# Altium schematic sheet HVSchematic.SchDoc
size A
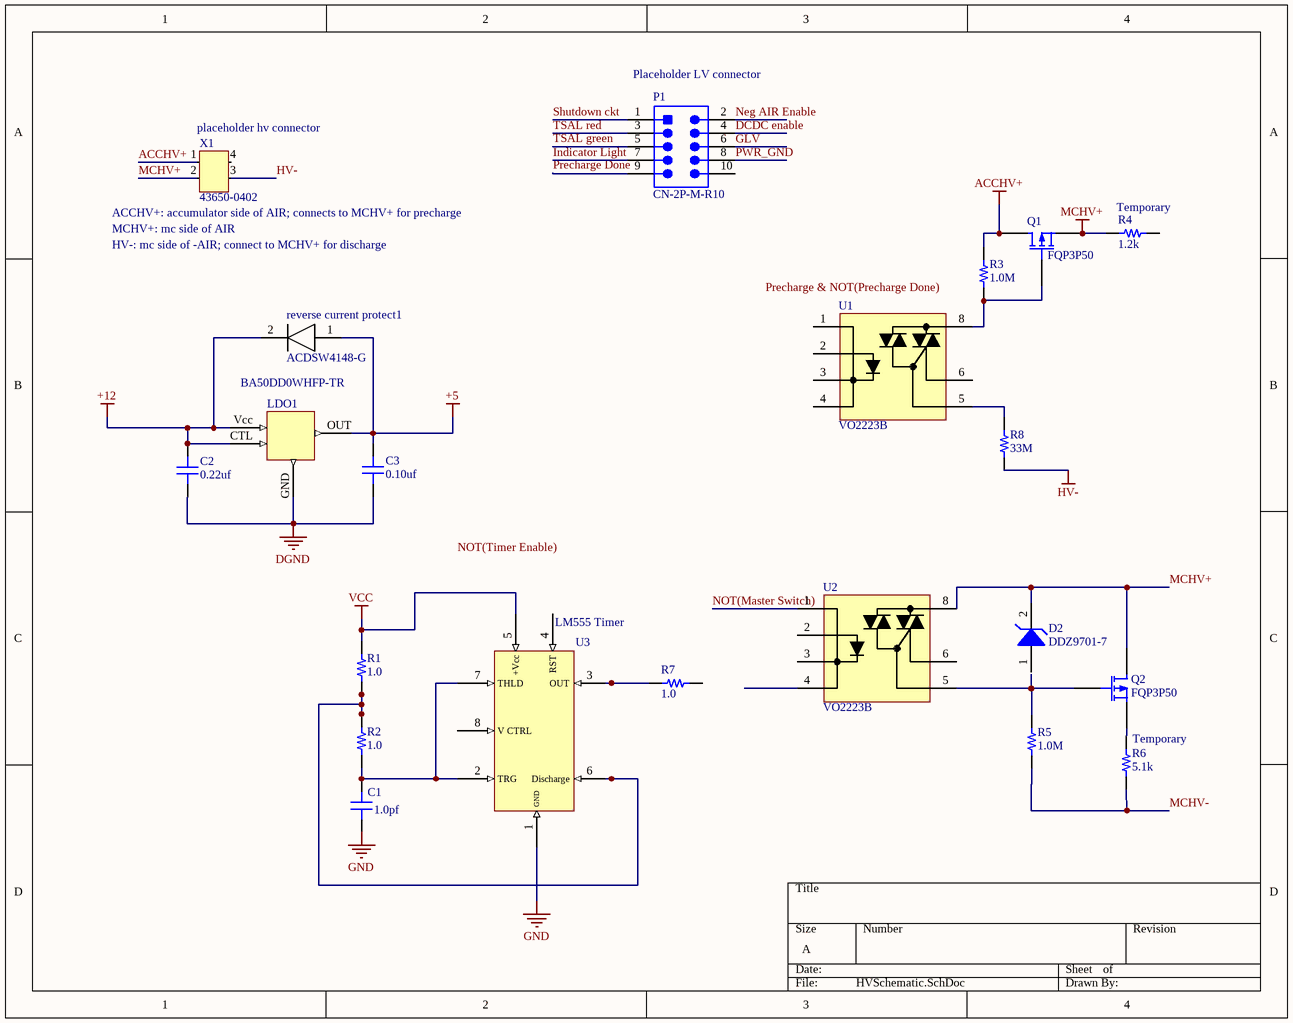
[diagram p0: HVSchematic.SchDoc]

## Parts
C1  value 1.0pf  [CAP 0402/1005]  (hidden comment: Capacitor MLCC 1.0pf 16V CAP 0402/1005)
C2  value 0.22uf  [CAP 0805/2012]  (hidden comment: Capacitor MLCC 0.22uf 50V CAP 0805/2012)
C3  value 0.10uf  [CAP 0805/2012]  (hidden comment: Capacitor MLCC 0.10uf 50V CAP 0805/2012)
D2  DDZ9701-7  [SOD123F]
LDO1  BA50DD0WHFP-TR  [HRP5]
P1  CN-2P-M-R10  [HDR2X5_SMT]
Q1  FQP3P50  [TO-220AB]
Q2  FQP3P50  [TO-220AB]
R1  value 1.0  [RES 0402/1005]  (hidden comment: Resistor 1.0 0402 1/10W 1%)
R2  value 1.0  [RES 0402/1005]  (hidden comment: Resistor 1.0 0402 1/10W 1%)
R3  value 1.0M  [RES 0603/1608]  (hidden comment: Resistor 1.0M 0603 1/10W 10%)
R4  Temporary  value 1.2k  [RES 0603/1608]
R5  value 1.0M  [RES 0603/1608]  (hidden comment: Resistor 1.0M 0603 1/10W 1%)
R6  Temporary  value 5.1k  [RES 0603/1608]
R7  value 1.0  [RES 0402/1005]  (hidden comment: Resistor 1.0 0402 1/10W 1%)
R8  value 33M  [RES 0603/1608]  (hidden comment: Resistor 33M 0603 1/10W 10%)
reverse_current_protect1  ACDSW4148-G  [DIODE SOD123]
U1  VO2223B  [Option 7]
U2  VO2223B  [Option 7]
U3  LM555 Timer  [SOIC-8]
X1  43650-0402  [Molex_43650_0402]

## Nets
+5: C3.2 LDO1.OUT reverse_current_protect1.1
+12: C2.2 LDO1.CTL LDO1.Vcc reverse_current_protect1.2
ACCHV+: Q1.2(D) R3.1 X1.1
DGND: C2.1 C3.1 LDO1.GND
GND: U3.1(GND)
HV-: R8.1 X1.3
MCHV+: D2.2(K) Q1.3(S) Q2.2(D) R4.1 U2.8 X1.2
VCC: R1.2 U3.5(+Vcc)
DCDC enable: P1.4
GLV: P1.6
Indicator Light: P1.7
MCHV-: R5.1 R6.1
Neg AIR Enable: P1.2
NOT(Master Switch): U2.1
Precharge Done: P1.9
PWR_GND: P1.8
Shutdown ckt: P1.1
TSAL green: P1.5
TSAL red: P1.3
NetC1_2: C1.2 R2.2 U3.2(TRG) U3.7(THLD)
NetQ1_1: Q1.1(G) R3.2 U1.8
NetQ2_1: Q2.1(G) R5.2 U2.5
NetQ2_3: Q2.3(S) R6.2
NetR1_1: R1.1 R2.1 U3.6(Discharge)
NetR7_1: R7.1 U3.3(OUT)
NetR8_2: R8.2 U1.5

Not connected (* = marked no-connect by the designer): C1 1; D2 1(A); P1 10; R4 2; R7 2; U1 1 2 3 4 6; U2 2 3 4 6; U3 4(RST) 8(V_CTRL); X1 4

## Notes on the sheet
- (near P1) Placeholder LV connector
- (near X1) placeholder hv connector
- (near X1) ACCHV+: accumulator side of AIR; connects to MCHV+ for precharge
- (near X1) MCHV+: mc side of AIR
- HV-: mc side of -AIR; connect to MCHV+ for discharge
- Labels drawn without touching a wire or pin: GND, NOT(Timer Enable), Precharge & NOT(Precharge Done)

## Library data of the parts
C1 = 1: idCapacitor: 1; Name: Cap_1.0pf_16V_CAP 0402/1005; Dielectric: Ceramic; Created_By: Nick Mah; Manufacturer_id: 1; Drawer_id: 1; Voltage_Rating: 16V; Package: CAP 0402/1005; Created_Date: 10/20/2018
C2 = 1065: Manufacturer_id: 1; idCapacitor: 1065; Name: Cap_0.22uf_50V_CAP 0805/2012; Dielectric: Ceramic; Created_By: Nick Mah; Drawer_id: 1; Voltage_Rating: 50V; Package: CAP 0805/2012; Created_Date: 10/20/2018
C3 = 1063: Manufacturer_id: 1; idCapacitor: 1063; Name: Cap_0.10uf_50V_CAP 0805/2012; Dielectric: Ceramic; Created_By: Nick Mah; Drawer_id: 1; Voltage_Rating: 50V; Package: CAP 0805/2012; Created_Date: 10/20/2018
D2 = 10: Zener Diode 14V 500mW ±5% Surface Mount SOD-123; Manufacturer_id: 8; idDiode: 10; Drawer_id: 1; Value: 14Vz; MfrPartNo: DDZ9701-7; Name: DDZ9701; Type: Zener; Num_Circuits: 1; Power: 500mW; Package: SOD-123; Link: https://www.digikey.com/product-detail/en/diodes-incorporated/DDZ9701-7/DDZ9701-7DICT-ND/3877402; ComponentLink1Description: Datasheet; ComponentLink1URL: https://www.diodes.com/assets/Datasheets/ds30410.pdf; Supplier1: Digi-Key; Supplier1PartNo: DDZ9701-7DICT-ND
LDO1 = 6: Manufacturer_id: 1; idPMIC_Lin: 6; Name: BA50DD0WHFP-TR Linear Voltage Regulator 5; Value: 5V; Vin(Min): 3V; Vin(Max): 33V; Current_Rating: 2A; Dropout_Voltage: 0.7V; Drawer_id: 1; Vout(Max): 5V; Link: https://www.mouser.com/ProductDetail/ROHM-Semiconductor/BA50DD0WHFP-TR?qs=4kLU8WoGk0sFpKnESpdNFg%3D%3D
P1 = 4: 2 row connector; Manufacturer_id: 1; MfrPartNo: 5103309-1; idConn: 4; Name: CONN_TE_2X5POS; Value: CONN; Voltage_Rating: None; Num_Contacts: 10; Num_Rows: 2; Pitch: 2.54mm; Created_By: Aiku; Drawer_id: 1; Link: https://www.digikey.com/product-detail/en/5103309-1/A33160-ND/1114898?utm_campaign=buynow&WT.z_cid=ref_octopart_dkc_buynow&utm_medium=aggregator&curr=usd&site=us&utm_source=octopart; ComponentLink1Description: Datasheet
Q1 Q2 = 5: Manufacturer_id: 1; idFETs: 5; Value: P_Channel; Vdss: 500V; Id: 2.7A; Rds_On: 4Ohms; Vgs(typ): 4.0v; Vgs(Max): 5.0V; Power(Max): 85W; Created_By: Angel; Drawer_id: 1; Name: FQP3P50; Num_Circuits: 1; Package: TO-220; MfrPartNo: FQP3P50; Link: https://www.digikey.com/product-detail/en/on-semiconductor/FQP3P50/FQP3P50-ND/1055021; Supplier1: Digi-Key; Supplier1PartNo: FQP3P50-ND
R1 R2 R7 = 1: idResistor: 1; Name: Res_1.0_0402_1/10W_1%; Created_By: Nick Mah; Supplier 1: Digi-Key; Manufacturer_id: 1; Drawer_id: 1; Tolerance: 1%; Power: 1/10W; Package: 0402; ComponentLink1Description: Datasheet; Created_Date: 2018-10-20
R3 = 2341: Manufacturer_id: 1; idResistor: 2341; Name: Res_1.0M_0603_1/10W_10%; Created_By: Nick Mah; Supplier 1: Digi-Key; Drawer_id: 1; Tolerance: 10%; Power: 1/10W; Package: 0603; ComponentLink1Description: Datasheet; Created_Date: 2018-10-20
R4 = 2306: Manufacturer_id: 1; idResistor: 2306; Name: Res_1.2k_0603_1/10W_10%; Tolerance: 10%; Power: 1/10W; Created_By: Nick Mah; Supplier 1: Digi-Key; Drawer_id: 1; Package: 0603; ComponentLink1Description: Datasheet; Created_Date: 2018-10-20
R5 = 361: Manufacturer_id: 1; idResistor: 361; Name: Res_1.0M_0603_1/10W_1%; Created_By: Nick Mah; Supplier 1: Digi-Key; Drawer_id: 1; Tolerance: 1%; Power: 1/10W; Package: 0603; ComponentLink1Description: Datasheet; Created_Date: 2018-10-20
R6 = 306: Manufacturer_id: 1; idResistor: 306; Name: Res_5.1k_0603_1/10W_1%; Tolerance: 1%; Power: 1/10W; Created_By: Nick Mah; Supplier 1: Digi-Key; Drawer_id: 1; Package: 0603; ComponentLink1Description: Datasheet; Created_Date: 2018-10-20
R8 = 2359: Manufacturer_id: 1; idResistor: 2359; Name: Res_33M_0603_1/10W_10%; Created_By: Nick Mah; Supplier 1: Digi-Key; Drawer_id: 1; Tolerance: 10%; Power: 1/10W; Package: 0603; ComponentLink1Description: Datasheet; Created_Date: 2018-10-20
reverse_current_protect1 = 9: Manufacturer_id: 1; idDiode: 9; Drawer_id: 1; Name: ACDSW4148-G Swtiching Diode; ComponentLink1URL: https://www.mouser.com/ProductDetail/Comchip-Technology/ACDSW4148-G?qs=vdiGlTBG6Jtfiahn88v1XQ%3D%3D
U1 U2 = 19: Optocoupler, Power Phototriac; Manufacturer_id: 1; idIC_Misc: 19; Name: VO2223B Optocoupler; Drawer_id: 1
U3 = 17: Manufacturer_id: 1; idIC_Misc: 17; Drawer_id: 1; Name: LM555 Timer
X1 = 6: Manufacturer_id: 4; idConn: 6; Drawer_id: 1; Name: Molex 43650_0402; Value: CONN; Voltage_Rating: 600V; Pitch: 3mm; Created_By: Nick; MfrPartNo: 43650-0402; Num_Contacts: 4; Num_Rows: 1; Package: Conn; Link: https://www.digikey.com/product-detail/en/molex-llc/0436500402/WM11252-ND/3310554; ComponentLink1Description: Datasheet; ComponentLink1URL: https://www.mouser.com/datasheet/2/276/0436500402_PCB_HEADERS-148886.pdf; Supplier1: Digi-Key; Supplier1PartNo: WM11252-ND